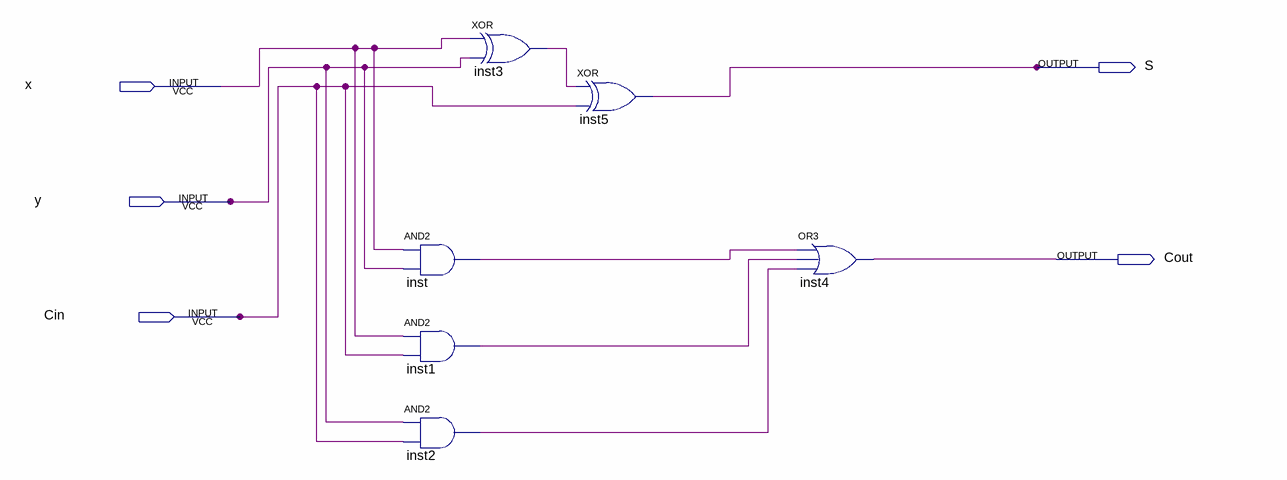
[diagram p0: schematic sheet]
// Quartus schematic full_adder_one_bit.bdf as structural Verilog: 6 symbols, 5 pins
module full_adder_one_bit (
  input  x,
  input  y,
  input  Cin,
  output S,
  output Cout
);

  wire inst1_out, inst2_out, inst3_out, inst_out;

  and inst (inst_out, x, y);
  and inst1 (inst1_out, x, Cin);
  and inst2 (inst2_out, y, Cin);
  xor inst3 (inst3_out, x, y);
  xor inst5 (S, inst3_out, Cin);
  or inst4 (Cout, inst_out, inst1_out, inst2_out);
endmodule
